# Altium schematic sheet RepCounter.SchDoc
size A; SheetNumber: 1; SheetTotal: 1
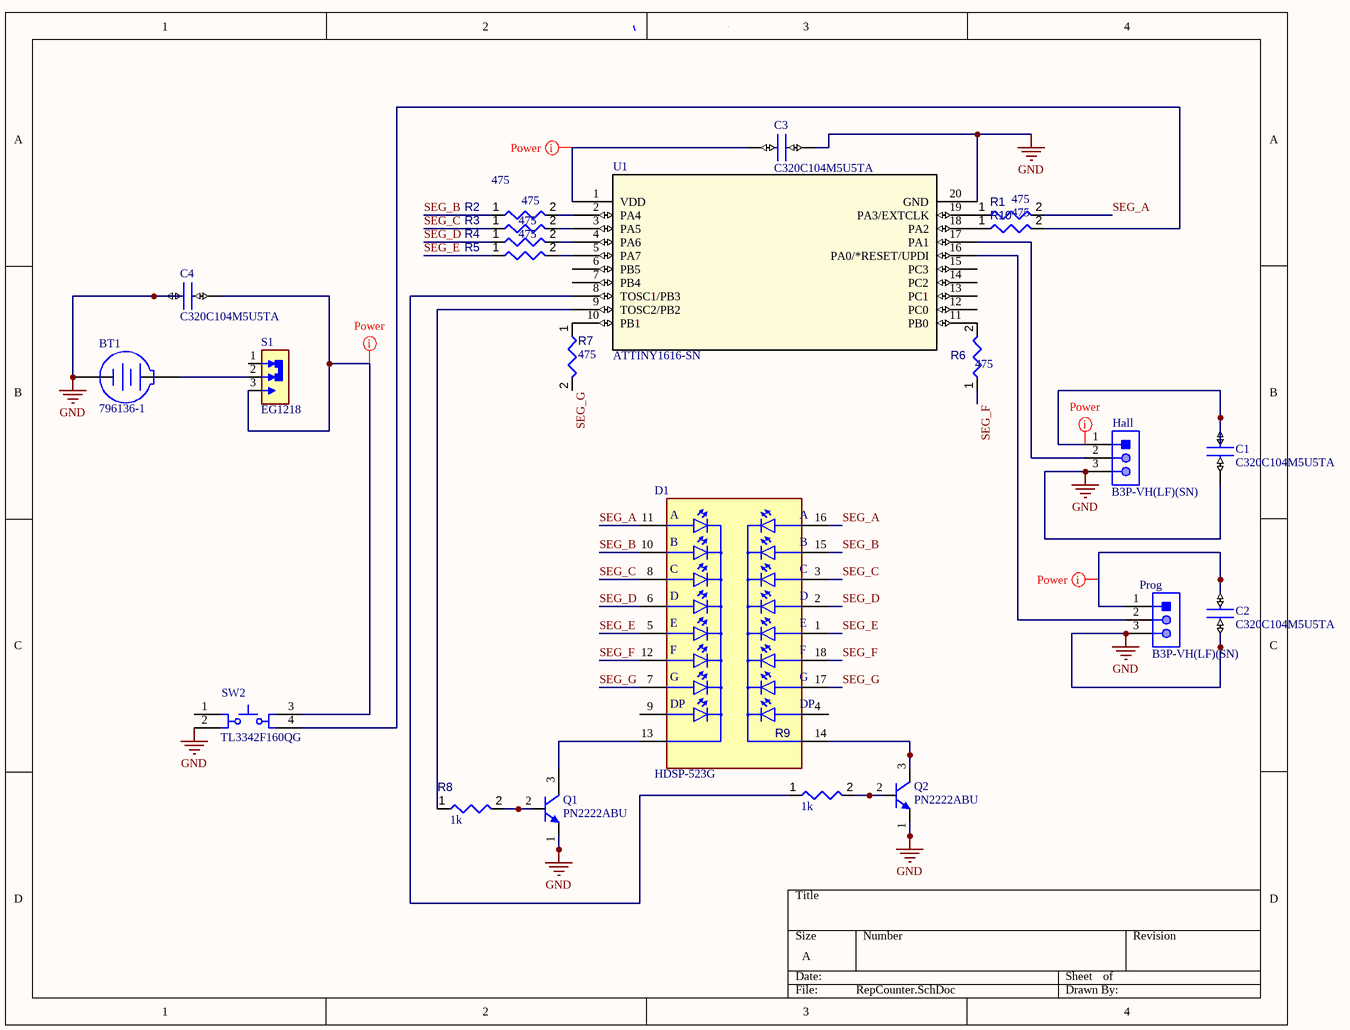
[diagram p0: RepCounter.SchDoc]

## Parts
BT1  796136-1  [TECO-796136-1_V]
C1  C320C104M5U5TA  [C320C]
C2  C320C104M5U5TA  [C320C]
C3  C320C104M5U5TA  [C320C]
C4  C320C104M5U5TA  [C320C]
D1  HDSP-523G  [LED_HDSP-523G]
Hall  B3P-VH(LF)(SN)  [JST-B3P-VH(LF)(SN)-3_V]
Prog  B3P-VH(LF)(SN)  [JST-B3P-VH(LF)(SN)-3_V]
Q1  PN2222ABU  [FAIR-TO-92]
Q2  PN2222ABU  [FAIR-TO-92]
R1  value 475  [RESA60-630X240]  (hidden comment: MFR-25FBF52-475R)
R2  value 475  [RESA60-630X240]  (hidden comment: MFR-25FBF52-475R)
R3  value 475  [RESA60-630X240]  (hidden comment: MFR-25FBF52-475R)
R4  value 475  [RESA60-630X240]  (hidden comment: MFR-25FBF52-475R)
R5  value 475  [RESA60-630X240]  (hidden comment: MFR-25FBF52-475R)
R6  value 475  [RESA60-630X240]  (hidden comment: MFR-25FBF52-475R)
R7  value 475  [RESA60-630X240]  (hidden comment: MFR-25FBF52-475R)
R8  value 1k  [RESA60-630X240]  (hidden comment: MFR-25FBF52-1K)
R9  value 1k  [RESA60-630X240]  (hidden comment: MFR-25FBF52-1K)
R10  value 475  [RESA60-630X240]  (hidden comment: MFR-25FBF52-475R)
S1  EG1218  [SW_EG1218]
SW2  TL3342F160QG  [ESWI-TL3342F160QG_V]
U1  ATTINY1616-SN  [SOIC20_300MIL_MCH]

## Nets
GND: BT1.2(-) C1.2 C2.2 C3.2 C4.1 Hall.3 Prog.3 Q1.1(E) Q2.1(E) SW2.2 U1.20(GND)
SEG_A: D1.11(A2) D1.16(A1) R1.2
SEG_B: D1.10(B2) D1.15(B1) R2.1
SEG_C: D1.3(C1) D1.8(C2) R3.1
SEG_D: D1.2(D1) D1.6(D2) R4.1
SEG_E: D1.1(E1) D1.5(E2) R5.1
SEG_F: D1.12(F2) D1.18(F1) R6.1
SEG_G: D1.7(G2) D1.17(G1) R7.2
NetBT1_1: BT1.1(+) S1.2(COM)
NetC1_1: C1.1 Hall.1
NetC2_1: C2.1 Prog.1
NetC3_1: C3.1 U1.1(VDD)
NetC4_2: C4.2 S1.3(NO) SW2.3
NetD1_13: D1.13(COM2) Q1.3(C)
NetD1_14: D1.14(COM1) Q2.3(C)
NetHall_2: Hall.2 U1.17(PA1)
NetProg_2: Prog.2 U1.16(PA0/*RESET/UPDI)
NetQ1_2: Q1.2(B) R8.2
NetQ2_2: Q2.2(B) R9.2
NetR1_1: R1.1 U1.19(PA3/EXTCLK)
NetR2_2: R2.2 U1.2(PA4)
NetR3_2: R3.2 U1.3(PA5)
NetR4_2: R4.2 U1.4(PA6)
NetR5_2: R5.2 U1.5(PA7)
NetR6_2: R6.2 U1.11(PB0)
NetR7_1: R7.1 U1.10(PB1)
NetR8_1: R8.1 U1.9(TOSC2/PB2)
NetR9_1: R9.1 U1.8(TOSC1/PB3)
NetR10_1: R10.1 U1.18(PA2)
NetR10_2: R10.2 SW2.4

Not connected (* = marked no-connect by the designer): D1 4(DP1) 9(DP2); S1 1(NC); SW2 1; U1 6(PB5) 7(PB4) 12(PC0) 13(PC1) 14(PC2) 15(PC3)

## Layout directives
mark named Power: NetC1_1, NetC2_1, NetC3_1, NetC4_2

## Notes on the sheet
- (in symbol HDSP-523G) A; B; C; D; E; F; G; DP

## Library data of the parts
BT1 = CMP-002-00002-2: Battery Connector, 1 Cell, CR2032, 2-Pin SMD, RoHS, Tape and Reel; Manufacturer: TE Connectivity; Max Voltage Rating (AC): 30V; Connector Type: BatteryHolder; Batteries: 1; Datasheet URL: http://www.te.com/commerce/DocumentDelivery/DDEController?Action=srchrtrv&DocNm=796136&DocType=Customer+Drawing&DocLang=English&DocFormat=pdf&PartCntxt=796136-1; Contact Plating: Tin; Case/Package: 796136-1; Colour: Black; Package Reference: 796136-1; Package Quantity: 400; Pins: 2; Mounting Technology: SM; RoHS Compliant: True; Datasheet Version: Dec-13; Package Description: 2-Pin Surface Mount Device, Body 32.31 x 19.05 mm; Packaging: TapeandReel; Manufacturer URL: http://www.te.com/; Contact Material: Bronze
C1-C4 = C320C104M5U5TA: C320 C 100nF Ceramic Multilayer Capacitor, 50 VDC, +85degC, Z5U Dielec, +/-20% | KEMET C320C104M5U5TA; SnapEDA_Link: https://www.snapeda.com/parts/C320C104M5U5TA/KEMET/view-part/?ref=snap; Package: Radial KEMET; Value: *; MF: KEMET; MP: C320C104M5U5TA; Check_prices: https://www.snapeda.com/parts/C320C104M5U5TA/KEMET/view-part/?ref=eda
D1 = HDSP-523G: Displays Segmented Panel 2DIGIT 16LED Green CC 18-Pin DIP Tube; MF: Avago Technologies; SnapEDA_Link: https://www.snapeda.com/parts/HDSP-523G/Avago/view-part/?ref=snap; Package: None; Value: *; MP: HDSP-523G; Check_prices: https://www.snapeda.com/parts/HDSP-523G/Avago/view-part/?ref=eda
Hall Prog = CMP-002-00026-2: Male Header, Pitch 3.96 mm, 1 x 3 Position, Height 10.9 mm, Tail Length 3.7 mm, -25 to 85 degC, RoHS, Bulk; Manufacturer: JST; Case/Package: B3P-VH(LF)(SN); Connector Type: Header; Datasheet Version: May-16; Mounting Technology: TH; Package Description: Male Header, Pitch 3.96 mm, 1 x 3 Position, Height 10.9 mm, Tail Length 3.7 mm; Gender: Male; Manufacturer URL: http://www.jst.com/home2.html; Package Reference: B3P-VH(LF)(SN); Datasheet URL: http://www.jst-mfg.com/product/pdf/eng/eVH.pdf; Min Operating Temperature: -25°C; Max Operating Temperature: 85°C; RoHS Compliant: Unknown
Q1 Q2 = CMP-013-00009-7: NPN General-Purpose Amplifier, 40 V, -55 to 150 degC, 3-Pin TO-92, RoHS, Bulk; Manufacturer: Fairchild; hFE Min: 100; Frequency: 300MHz; Elements: 1; Power: 625mW; Vce Max: 1V; Datasheet URL: https://www.fairchildsemi.com/datasheets/PN/PN2222A.pdf; Case/Package: TO-226-3; Datasheet Version: Rev. 1.1.0, 07/2014; Pins: 3; Mounting Technology: TH; Packaging: Bulk; Min Operating Temperature: -55°C; Package Reference: TO-92; Max Operating Temperature: 150°C; Package Quantity: 1000; Package Description: 3-Pin Transistor Outline Package, Body Dia 4.79 mm, Pitch 1.27 mm; RoHS Compliant: True
R1-R7 R10 = CMP-009-00056-4: Axial Resistor, 475 Ohm, +/- 1%, 0.25 W, -55 to 155 degC, 2-Pin THD, RoHS, Bulk; Manufacturer: Yageo; Voltage Rating: 250V; Power: 250mW; Case/Package: Axial; Datasheet URL: http://www.yageo.com/documents/recent/Yageo%20LR_MFR_2013.pdf; Tolerance: 1%; RoHS Compliant: True; Mounting Technology: TH; Packaging: Bulk; Package Description: 2-Pin Axial Lead, Dia 2.4 mm, Body Length 6.3 mm; Max Operating Temperature: 155°C; Package Reference: MFR-25; Datasheet Version: Apr-13; Min Operating Temperature: -55°C; Package Quantity: 200; Manufacturer URL: http://www.yageo.com/
R8 R9 = CMP-009-00048-4: Axial Resistor, 1 KOhm, +/- 1%, 250 mW, -55 to 155 degC, 2-Pin THD, RoHS, Bulk; Manufacturer: Yageo; Voltage Rating: 250V; Power: 250mW; Min Operating Temperature: -55°C; Max Operating Temperature: 155°C; Tolerance: 1%; Package Reference: MFR-25; Composition: CarbonFilm; Mounting Technology: TH; Packaging: Bulk; Case/Package: Axial; Datasheet URL: http://www.yageo.com/documents/recent/Yageo%20LR_MFR_2013.pdf; Package Quantity: 200; Manufacturer URL: http://www.yageo.com/; Package Description: 2-Pin Axial Lead, Dia 2.4 mm, Body Length 6.3 mm; Datasheet Version: Apr-13; RoHS Compliant: True
S1 = EG1218: Slide Switch, EG Series, SPDT, Non-Shorting, ON-ON, 200mA DC, 30VDC, PC Pin | E-Switch EG1218; SnapEDA_Link: https://www.snapeda.com/parts/EG1218/E-Switch/view-part/?ref=snap; Package: None; Value: *; MF: E-Switch; MP: EG1218; Check_prices: https://www.snapeda.com/parts/EG1218/E-Switch/view-part/?ref=eda
SW2 = CMP-011-00008-2: Tactile Switch, SPST-NO, 50 mA, 12 V, 4-Pin SMD, RoHS, Tape and Reel; Manufacturer: E-Switch; Operating Force: 1.6N; Current Rating: 50mA; Throw Configuration: SPST; Max Voltage Rating (DC): 12V; Datasheet URL: http://spec_sheets.e-switch.com/specs/P010632.pdf; Manufacturer URL: http://www.e-switch.ch/en/; Mounting Technology: SM; Case/Package: TL3342F160QG; Package Quantity: 3000; Contact Material: Silver; Package Description: 4-Pin Surface Mount Device, Body 5 x 5 mm, Pitch 6.3 mm; Package Reference: TL3342F160QG; Datasheet Version: Rev. I, 12/2010; Voltage Rating (DC): 12V; Contact Plating: Silver; RoHS Compliant: True; Packaging: TapeandReel
U1 = ATTINY1616-SN: Description; Manufacturer_Name: Microchip; Copyright: Copyright (C) 2025 Ultra Librarian. All rights reserved.; Manufacturer_Part_Number: ATTINY1616-SN; RefDes: RefDes; Type: Type